# Altium project mb1045.PrjPCB (part 1 of 3)
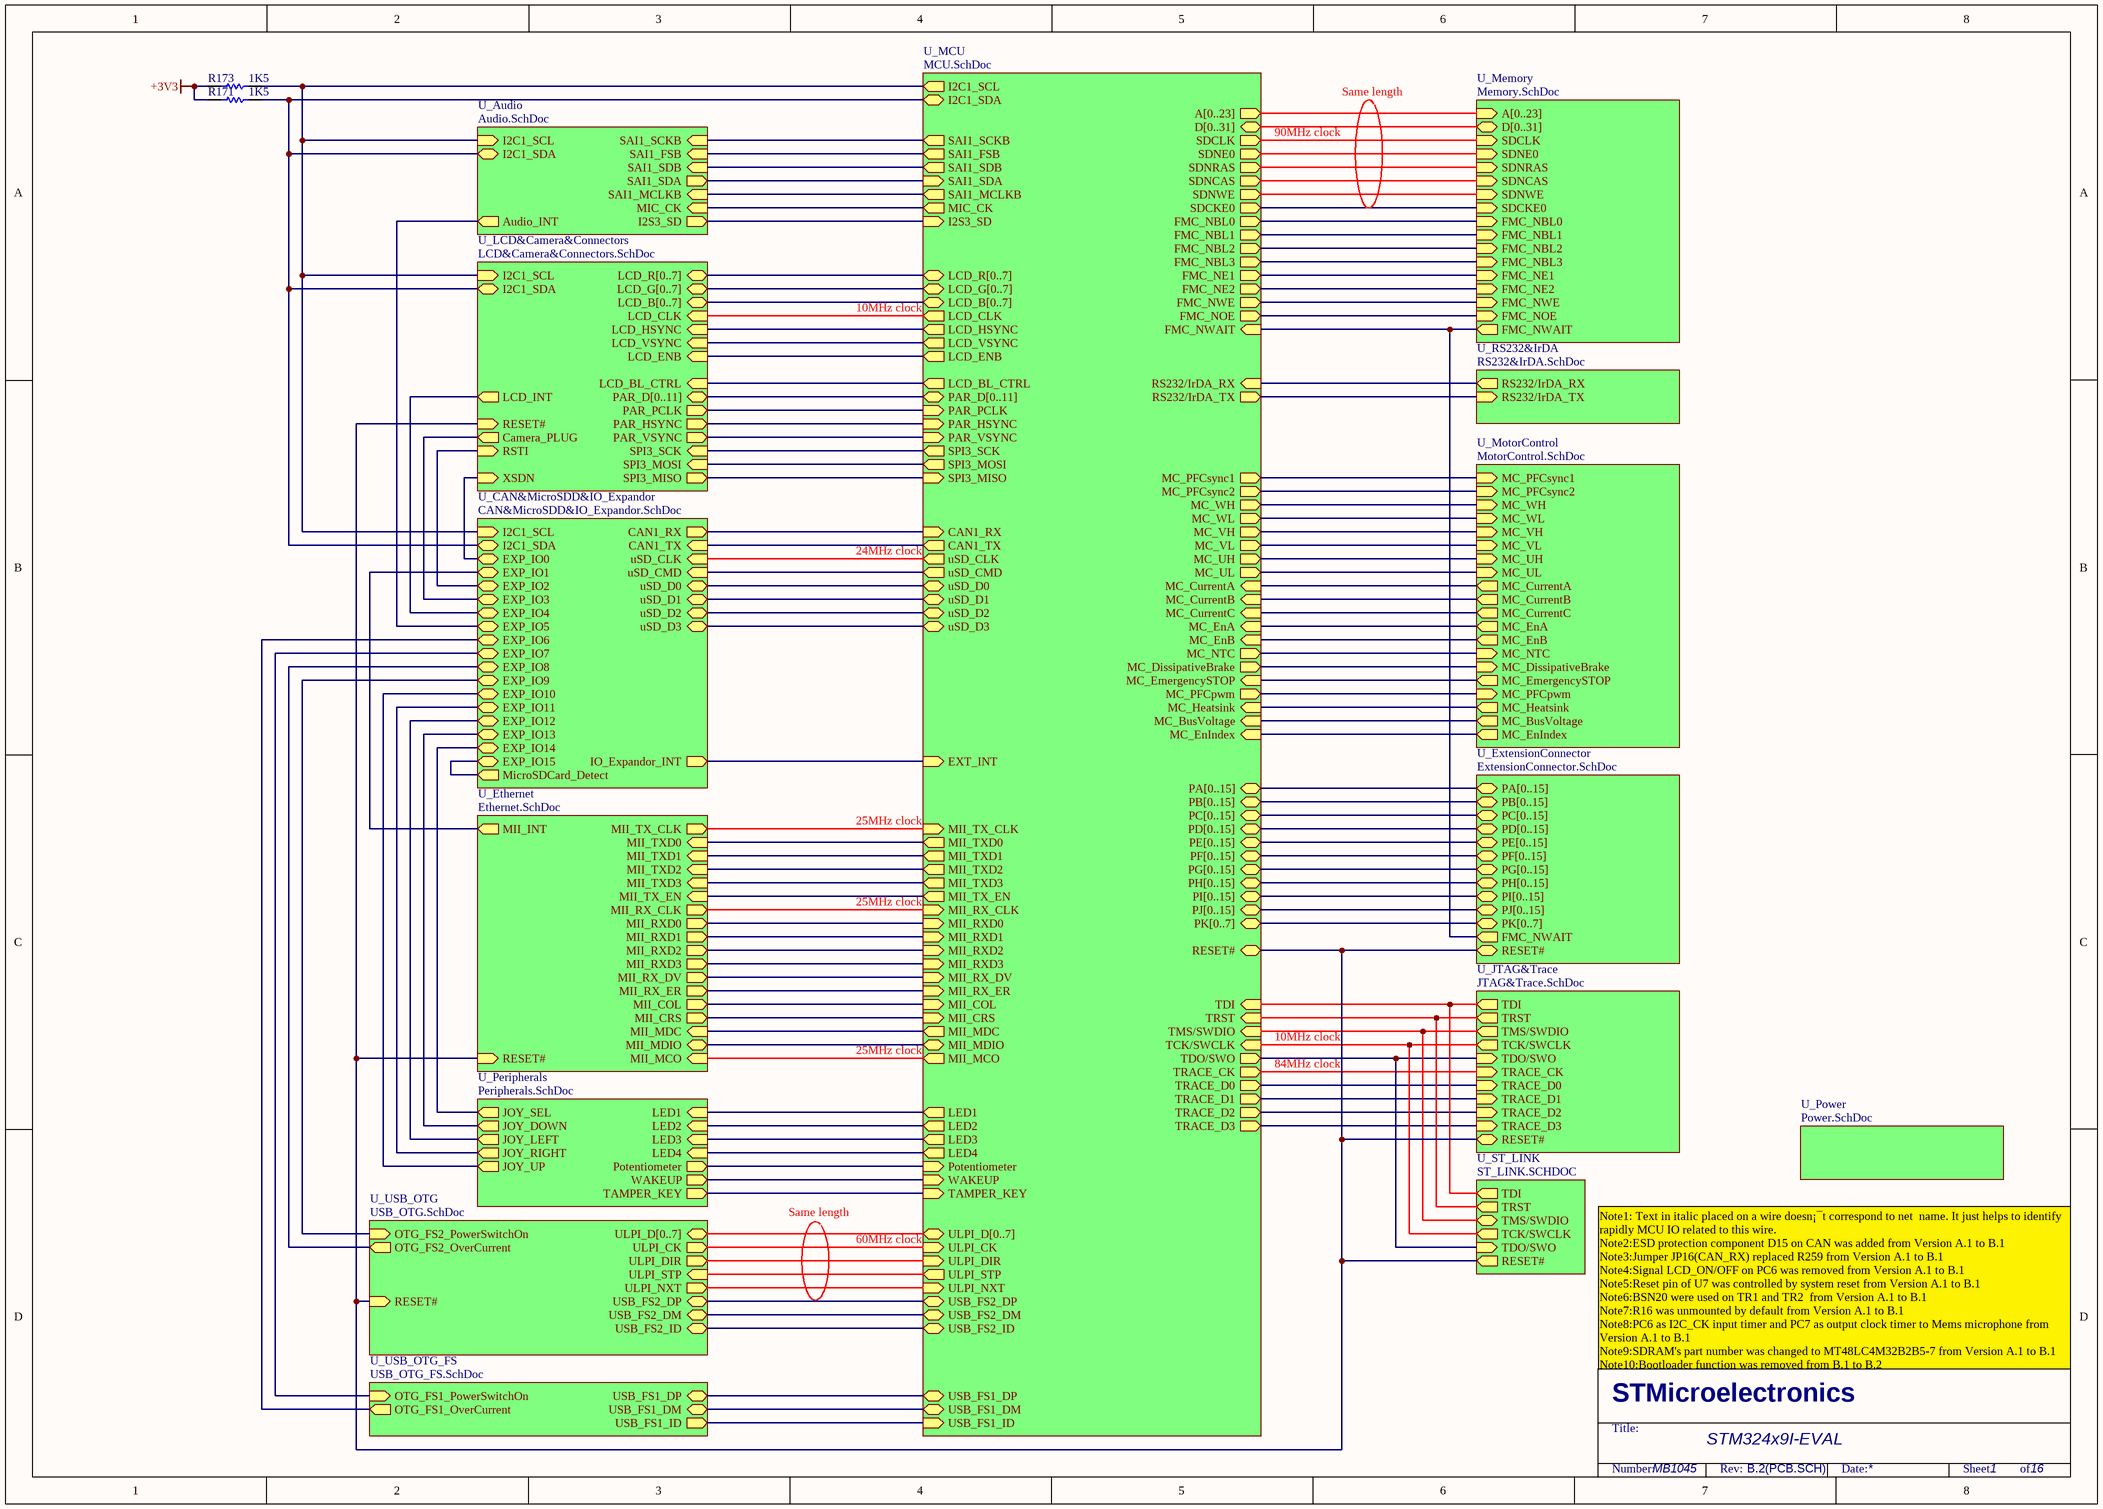
[diagram p0: mb1045.SchDoc]
16 sheets, 609 parts. Net scope: hierarchical (ports join the sheet entries above them; power ports are global).
Sheets:
  mb1045.SchDoc
    U_Audio = Audio.SchDoc
    U_JTAG&Trace = JTAG&Trace.SchDoc
    U_MCU = MCU.SchDoc
    U_Memory = Memory.SchDoc
    U_MotorControl = MotorControl.SchDoc
    U_Peripherals = Peripherals.SchDoc
    U_Power = Power.SchDoc
    U_RS232&IrDA = RS232&IrDA.SchDoc
    U_ST_LINK = ST_LINK.SCHDOC
    U_USB_OTG = USB_OTG.SchDoc
    U_USB_OTG_FS = USB_OTG_FS.SchDoc
    U_CAN&MicroSDD&IO_Expandor = CAN&MicroSDD&IO_Expandor.SchDoc
    U_ExtensionConnector = ExtensionConnector.SchDoc
    U_LCD&Camera&Connectors = LCD&Camera&Connectors.SchDoc
    U_Ethernet = Ethernet.SchDoc

## Sheet mb1045.SchDoc
size A3; Revision: B.2(PCB.SCH)

### Parts
R171  1K5  [0603R]
R173  1K5  [0603R]

### Sub-sheets
U_Audio = Audio.SchDoc: SAI1_SCKB (in), SAI1_FSB (in), SAI1_SDB (in), SAI1_SDA (out), Audio_INT (out), I2C1_SDA (bidir), I2C1_SCL (in), SAI1_MCLKB (in), MIC_CK (in), I2S3_SD (out)
U_CAN&MicroSDD&IO_Expandor = CAN&MicroSDD&IO_Expandor.SchDoc: CAN1_TX (in), CAN1_RX (out), uSD_CLK (in), uSD_CMD (in), uSD_D0 (bidir), uSD_D1 (bidir), uSD_D2 (bidir), uSD_D3 (bidir), MicroSDCard_Detect (out), I2C1_SCL (in), I2C1_SDA (bidir), IO_Expandor_INT (out), EXP_IO2 (bidir), EXP_IO3 (bidir), EXP_IO4 (bidir), EXP_IO5 (bidir), EXP_IO6 (bidir), EXP_IO7 (bidir), EXP_IO8 (bidir), EXP_IO1 (bidir), EXP_IO9 (bidir), EXP_IO10 (bidir), EXP_IO11 (bidir), EXP_IO12 (bidir), EXP_IO13 (bidir), EXP_IO14 (bidir), EXP_IO15 (bidir), EXP_IO0 (bidir)
U_Ethernet = Ethernet.SchDoc: MII_TXD0 (in), MII_TX_EN (in), MII_TX_CLK (out), MII_RXD0 (out), MII_RX_ER (out), MII_RX_DV (out), MII_RX_CLK (out), MII_COL (out), MII_CRS (out), MII_MDC (in), MII_MDIO (bidir), RESET# (in), MII_TXD1 (in), MII_TXD2 (in), MII_TXD3 (in), MII_RXD1 (out), MII_RXD2 (out), MII_RXD3 (out), MII_INT (out), MII_MCO (in)
U_ExtensionConnector = ExtensionConnector.SchDoc: PA[0..15] (bidir), PB[0..15] (bidir), PC[0..15] (bidir), PD[0..15] (bidir), PE[0..15] (bidir), PF[0..15] (bidir), PG[0..15] (bidir), PH[0..15] (bidir), PI[0..15] (bidir), PJ[0..15] (bidir), PK[0..7] (bidir), RESET# (bidir), FMC_NWAIT (out)
U_JTAG&Trace = JTAG&Trace.SchDoc: TDI (out), RESET# (bidir), TRACE_D3 (in), TRACE_D2 (in), TRACE_D1 (in), TRACE_D0 (in), TRACE_CK (in), TRST (out), TMS/SWDIO (out), TCK/SWCLK (out), TDO/SWO (in)
U_LCD&Camera&Connectors = LCD&Camera&Connectors.SchDoc: LCD_R[0..7] (bidir), LCD_HSYNC (in), LCD_VSYNC (in), LCD_CLK (in), LCD_ENB (in), LCD_BL_CTRL (in), I2C1_SDA (bidir), I2C1_SCL (in), LCD_B[0..7] (bidir), LCD_G[0..7] (bidir), RSTI (in), XSDN (in), PAR_HSYNC (out), PAR_PCLK (out), PAR_VSYNC (out), PAR_D[0..11] (bidir), SPI3_SCK (in), SPI3_MISO (out), SPI3_MOSI (in), LCD_INT (out), Camera_PLUG (out), RESET# (in)
U_MCU = MCU.SchDoc: PA[0..15] (bidir), PB[0..15] (bidir), PC[0..15] (bidir), PD[0..15] (bidir), PE[0..15] (bidir), PF[0..15] (bidir), PG[0..15] (bidir), PH[0..15] (bidir), PI[0..15] (bidir), WAKEUP (in), MC_EnA (in), MII_RX_CLK (in), MC_EnB (in), MII_MDIO (bidir), MC_EnIndex (in), ULPI_CK (in), MC_EmergencySTOP (in), MII_RX_DV (in), MC_UL (out), LCD_BL_CTRL (out), MC_PFCsync1 (out), RS232/IrDA_TX (out), RS232/IrDA_RX (in), USB_FS1_ID (in), CAN1_RX (in), USB_FS1_DM (bidir), MC_PFCpwm (out), CAN1_TX (out), USB_FS1_DP (bidir), MC_PFCsync2 (out), TMS/SWDIO (in), TCK/SWCLK (in), TDI (in), MC_VL (out), MC_WL (out), TDO/SWO (out), MIC_CK (out), TRST (in), I2C1_SCL (out), MII_TXD3 (out), MC_DissipativeBrake (out), I2C1_SDA (bidir), USB_FS2_ID (bidir), USB_FS2_DM (bidir), USB_FS2_DP (bidir), ULPI_STP (out), MII_MDC (out), MC_CurrentA (in), MII_TXD2 (out), MC_CurrentB (in), MII_TX_CLK (in), MC_CurrentC (in), MII_RXD0 (in), MC_BusVoltage (in), MII_RXD1 (in), MC_Heatsink (in), MC_UH (out), MC_VH (out), uSD_D0 (bidir), MC_WH (out), uSD_D1 (bidir), uSD_D2 (bidir), SPI3_SCK (out), uSD_D3 (bidir), SPI3_MISO (in), uSD_CLK (out), SPI3_MOSI (out), TAMPER_KEY (in), MII_CRS (in), LCD_ENB (out), uSD_CMD (out), FMC_NOE (out), FMC_NWE (out), FMC_NWAIT (in), I2S3_SD (in), FMC_NE1 (out), FMC_NBL3 (out), FMC_NBL2 (out), EXT_INT (in), MII_RX_ER (in), ULPI_DIR (in), LCD_HSYNC (out), LCD_VSYNC (out), LCD_CLK (out), FMC_NBL0 (out), FMC_NBL1 (out), TRACE_CK (out), TRACE_D0 (out), TRACE_D2 (out), TRACE_D1 (out), SAI1_SDA (in), TRACE_D3 (out), SAI1_SDB (out), SAI1_SCKB (out), SAI1_FSB (out), SAI1_MCLKB (out), Potentiometer (in), SDNRAS (out), LED1 (out), LED2 (out), SDCLK (out), FMC_NE2 (out), LED4 (out), LED3 (out), MII_TX_EN (out), MC_NTC (out), MII_TXD0 (out), MII_TXD1 (out), SDNCAS (out), SDCKE0 (out), SDNE0 (out), MII_COL (in), ULPI_NXT (in), SDNWE (out), MII_RXD2 (in), MII_RXD3 (in), LCD_R[0..7] (bidir), LCD_G[0..7] (bidir), LCD_B[0..7] (bidir), D[0..31] (bidir), A[0..23] (out), ULPI_D[0..7] (bidir), RESET# (bidir), PJ[0..15] (bidir), PK[0..7] (bidir), PAR_HSYNC (in), PAR_PCLK (in), PAR_VSYNC (in), PAR_D[0..11] (bidir), MII_MCO (out)
U_Memory = Memory.SchDoc: FMC_NE2 (in), FMC_NE1 (in), FMC_NWE (in), FMC_NOE (in), FMC_NWAIT (out), FMC_NBL0 (in), FMC_NBL1 (in), D[0..31] (bidir), A[0..23] (in), SDNCAS (in), SDNWE (in), SDNRAS (in), SDNE0 (in), SDCKE0 (in), SDCLK (in), FMC_NBL3 (in), FMC_NBL2 (in)
U_MotorControl = MotorControl.SchDoc: MC_EmergencySTOP (out), MC_CurrentA (out), MC_CurrentB (out), MC_CurrentC (out), MC_PFCsync1 (in), MC_PFCsync2 (in), MC_WL (in), MC_VH (in), MC_VL (in), MC_UH (in), MC_UL (in), MC_WH (in), MC_NTC (in), MC_DissipativeBrake (in), MC_PFCpwm (in), MC_EnA (out), MC_EnB (out), MC_Heatsink (out), MC_BusVoltage (out), MC_EnIndex (out)
U_Peripherals = Peripherals.SchDoc: LED4 (in), LED3 (in), LED1 (in), LED2 (in), JOY_SEL (out), JOY_DOWN (out), JOY_LEFT (out), JOY_RIGHT (out), JOY_UP (out), Potentiometer (out), WAKEUP (out), TAMPER_KEY (out)
U_Power = Power.SchDoc: no entries
U_RS232&IrDA = RS232&IrDA.SchDoc: RS232/IrDA_TX (in), RS232/IrDA_RX (out)
U_ST_LINK = ST_LINK.SCHDOC: TDI (out), TRST (out), TMS/SWDIO (bidir), TCK/SWCLK (out), TDO/SWO (in), RESET# (out)
U_USB_OTG = USB_OTG.SchDoc: ULPI_D[0..7] (bidir), ULPI_CK (out), ULPI_DIR (out), ULPI_NXT (out), ULPI_STP (in), RESET# (in), USB_FS2_DM (bidir), USB_FS2_DP (bidir), OTG_FS2_PowerSwitchOn (in), OTG_FS2_OverCurrent (out), USB_FS2_ID (bidir)
U_USB_OTG_FS = USB_OTG_FS.SchDoc: OTG_FS1_PowerSwitchOn (in), OTG_FS1_OverCurrent (out), USB_FS1_DM (bidir), USB_FS1_DP (bidir), USB_FS1_ID (out)

### Nets
+3V3: R171.1 R173.1
I2C1_SCL: R173.2 ; sheet U_Audio/I2C1_SCL, sheet U_MCU/I2C1_SCL, sheet U_CAN&MicroSDD&IO_Expandor/I2C1_SCL, sheet U_LCD&Camera&Connectors/I2C1_SCL
I2C1_SDA: R171.2 ; sheet U_Audio/I2C1_SDA, sheet U_MCU/I2C1_SDA, sheet U_CAN&MicroSDD&IO_Expandor/I2C1_SDA, sheet U_LCD&Camera&Connectors/I2C1_SDA
PA4: sheet U_MCU/PAR_HSYNC, sheet U_LCD&Camera&Connectors/PAR_HSYNC
PA5: sheet U_MCU/ULPI_CK, sheet U_USB_OTG/ULPI_CK
PA6: sheet U_MCU/MC_EmergencySTOP, sheet U_MCU/PAR_PCLK, sheet U_MotorControl/MC_EmergencySTOP, sheet U_LCD&Camera&Connectors/PAR_PCLK
PA10: sheet U_MCU/RS232/IrDA_RX, sheet U_MCU/USB_FS1_ID, sheet U_RS232&IrDA/RS232/IrDA_RX, sheet U_USB_OTG_FS/USB_FS1_ID
PA11: sheet U_MCU/USB_FS1_DM, sheet U_USB_OTG_FS/USB_FS1_DM
PA13: sheet U_JTAG&Trace/TMS/SWDIO, sheet U_MCU/TMS/SWDIO, sheet U_ST_LINK/TMS/SWDIO
PA14: sheet U_JTAG&Trace/TCK/SWCLK, sheet U_MCU/TCK/SWCLK, sheet U_ST_LINK/TCK/SWCLK
PA15: sheet U_JTAG&Trace/TDI, sheet U_MCU/TDI, sheet U_ST_LINK/TDI
PAR_D1: sheet U_MCU/MC_VH, sheet U_MotorControl/MC_VH
PAR_D4: sheet U_MCU/SPI3_MISO, sheet U_LCD&Camera&Connectors/SPI3_MISO
PAR_D8: sheet U_MCU/SPI3_SCK, sheet U_LCD&Camera&Connectors/SPI3_SCK
PAR_D9: sheet U_MCU/uSD_CLK, sheet U_MCU/SPI3_MOSI, sheet U_CAN&MicroSDD&IO_Expandor/uSD_CLK, sheet U_LCD&Camera&Connectors/SPI3_MOSI
PB4: sheet U_JTAG&Trace/TRST, sheet U_MCU/TRST, sheet U_ST_LINK/TRST
PB7: sheet U_MCU/PAR_VSYNC, sheet U_LCD&Camera&Connectors/PAR_VSYNC
PB14: sheet U_MCU/USB_FS2_DM, sheet U_USB_OTG/USB_FS2_DM
PB15: sheet U_MCU/USB_FS2_DP, sheet U_USB_OTG/USB_FS2_DP
PC0: sheet U_MCU/ULPI_STP, sheet U_USB_OTG/ULPI_STP
PC13: sheet U_MCU/TAMPER_KEY, sheet U_Peripherals/TAMPER_KEY
PD4: sheet U_MCU/FMC_NOE, sheet U_Memory/FMC_NOE
PD5: sheet U_MCU/FMC_NWE, sheet U_Memory/FMC_NWE
PD7: sheet U_MCU/FMC_NE1, sheet U_Memory/FMC_NE1
PE0: sheet U_MCU/FMC_NBL0, sheet U_Memory/FMC_NBL0
PE1: sheet U_MCU/FMC_NBL1, sheet U_Memory/FMC_NBL1
PF6: sheet U_Audio/SAI1_SDB, sheet U_MCU/SAI1_SDB
PF7: sheet U_Audio/SAI1_MCLKB, sheet U_MCU/SAI1_MCLKB
PF8: sheet U_Audio/SAI1_SCKB, sheet U_MCU/SAI1_SCKB
PF9: sheet U_Audio/SAI1_FSB, sheet U_MCU/SAI1_FSB
PF10: sheet U_MCU/Potentiometer, sheet U_Peripherals/Potentiometer
PF11: sheet U_MCU/SDNRAS, sheet U_Memory/SDNRAS
PG6: sheet U_MCU/LED1, sheet U_Peripherals/LED1
PG7: sheet U_MCU/LED2, sheet U_Peripherals/LED2
PG8: sheet U_MCU/SDCLK, sheet U_Memory/SDCLK
PG9: sheet U_MCU/FMC_NE2, sheet U_Memory/FMC_NE2
PG10: sheet U_MCU/LED3, sheet U_Peripherals/LED3
PG12: sheet U_MCU/LED4, sheet U_Peripherals/LED4
PG15: sheet U_MCU/SDNCAS, sheet U_Memory/SDNCAS
PH2: sheet U_MCU/SDCKE0, sheet U_Memory/SDCKE0
PH3: sheet U_MCU/SDNE0, sheet U_Memory/SDNE0
PH4: sheet U_MCU/ULPI_NXT, sheet U_USB_OTG/ULPI_NXT
PH5: sheet U_MCU/SDNWE, sheet U_Memory/SDNWE
PH6: sheet U_MCU/MII_RXD2, sheet U_Ethernet/MII_RXD2
PH7: sheet U_MCU/MII_RXD3, sheet U_Ethernet/MII_RXD3
PI4: sheet U_MCU/FMC_NBL2, sheet U_Memory/FMC_NBL2
PI5: sheet U_MCU/FMC_NBL3, sheet U_Memory/FMC_NBL3
PI8: sheet U_MCU/EXT_INT, sheet U_CAN&MicroSDD&IO_Expandor/IO_Expandor_INT
PI11: sheet U_MCU/ULPI_DIR, sheet U_USB_OTG/ULPI_DIR
PI12: sheet U_MCU/LCD_HSYNC, sheet U_LCD&Camera&Connectors/LCD_HSYNC
PI13: sheet U_MCU/LCD_VSYNC, sheet U_LCD&Camera&Connectors/LCD_VSYNC
PI14: sheet U_MCU/LCD_CLK, sheet U_LCD&Camera&Connectors/LCD_CLK
PK7: sheet U_MCU/LCD_ENB, sheet U_LCD&Camera&Connectors/LCD_ENB
RESET#: sheet U_JTAG&Trace/RESET#, sheet U_MCU/RESET#, sheet U_ST_LINK/RESET#, sheet U_USB_OTG/RESET#, sheet U_ExtensionConnector/RESET#, sheet U_LCD&Camera&Connectors/RESET#, sheet U_Ethernet/RESET#
T_JTDO: sheet U_JTAG&Trace/TDO/SWO, sheet U_MCU/TDO/SWO, sheet U_ST_LINK/TDO/SWO
NetB4_1: sheet U_Peripherals/JOY_LEFT, sheet U_CAN&MicroSDD&IO_Expandor/EXP_IO12
NetB4_2: sheet U_Peripherals/JOY_SEL, sheet U_CAN&MicroSDD&IO_Expandor/EXP_IO14
NetB4_3: sheet U_Peripherals/JOY_DOWN, sheet U_CAN&MicroSDD&IO_Expandor/EXP_IO13
NetB4_4: sheet U_Peripherals/JOY_RIGHT, sheet U_CAN&MicroSDD&IO_Expandor/EXP_IO11
NetB4_6: sheet U_Peripherals/JOY_UP, sheet U_CAN&MicroSDD&IO_Expandor/EXP_IO10
NetC6_2: sheet U_MCU/MC_EnA, sheet U_MotorControl/MC_EnA
NetC7_2: sheet U_MCU/MC_PFCsync2, sheet U_MotorControl/MC_PFCsync2
NetC8_2: sheet U_MCU/MC_EnB, sheet U_MotorControl/MC_EnB
NetC9_2: sheet U_MCU/MC_EnIndex, sheet U_MotorControl/MC_EnIndex
NetC10_2: sheet U_MCU/MC_PFCpwm, sheet U_MotorControl/MC_PFCpwm
NetC11_1: sheet U_MCU/MC_Heatsink, sheet U_MotorControl/MC_Heatsink
NetC12_2: sheet U_MCU/MC_CurrentC, sheet U_MotorControl/MC_CurrentC
NetC13_2: sheet U_MCU/MC_CurrentB, sheet U_MotorControl/MC_CurrentB
NetC14_2: sheet U_MCU/MC_CurrentA, sheet U_MotorControl/MC_CurrentA
NetC15_1: sheet U_MCU/MC_BusVoltage, sheet U_MotorControl/MC_BusVoltage
NetC18_2: sheet U_MCU/MC_PFCsync1, sheet U_MotorControl/MC_PFCsync1
NetCN1_3: sheet U_MCU/MC_UH, sheet U_MotorControl/MC_UH
NetCN1_5: sheet U_MCU/MC_UL, sheet U_MotorControl/MC_UL
NetCN1_9: sheet U_MCU/MC_VL, sheet U_MotorControl/MC_VL
NetCN1_11: sheet U_MCU/MC_WH, sheet U_MotorControl/MC_WH
NetCN1_13: sheet U_MCU/MC_WL, sheet U_MotorControl/MC_WL
NetCN1_21: sheet U_MCU/MC_NTC, sheet U_MotorControl/MC_NTC
NetCN1_23: sheet U_MCU/MC_DissipativeBrake, sheet U_MotorControl/MC_DissipativeBrake
NetCN5_15: sheet U_CAN&MicroSDD&IO_Expandor/EXP_IO3, sheet U_LCD&Camera&Connectors/Camera_PLUG
NetCN12_6: sheet U_MCU/FMC_NWAIT, sheet U_Memory/FMC_NWAIT, sheet U_ExtensionConnector/FMC_NWAIT
NetCN13_12: sheet U_JTAG&Trace/TRACE_CK, sheet U_MCU/TRACE_CK
NetCN13_14: sheet U_JTAG&Trace/TRACE_D0, sheet U_MCU/TRACE_D0
NetCN13_16: sheet U_JTAG&Trace/TRACE_D1, sheet U_MCU/TRACE_D1
NetCN13_18: sheet U_JTAG&Trace/TRACE_D2, sheet U_MCU/TRACE_D2
NetCN13_20: sheet U_JTAG&Trace/TRACE_D3, sheet U_MCU/TRACE_D3
NetCN15_4: sheet U_MCU/USB_FS2_ID, sheet U_USB_OTG/USB_FS2_ID
NetCN17_1: sheet U_MCU/uSD_D2, sheet U_CAN&MicroSDD&IO_Expandor/uSD_D2
NetCN17_2: sheet U_MCU/uSD_D3, sheet U_CAN&MicroSDD&IO_Expandor/uSD_D3
NetCN17_3: sheet U_MCU/uSD_CMD, sheet U_CAN&MicroSDD&IO_Expandor/uSD_CMD
NetCN17_7: sheet U_MCU/uSD_D0, sheet U_CAN&MicroSDD&IO_Expandor/uSD_D0
NetCN17_8: sheet U_MCU/uSD_D1, sheet U_CAN&MicroSDD&IO_Expandor/uSD_D1
NetCN20_39: sheet U_CAN&MicroSDD&IO_Expandor/EXP_IO4, sheet U_LCD&Camera&Connectors/LCD_INT
NetCN20_43: sheet U_MCU/LCD_BL_CTRL, sheet U_LCD&Camera&Connectors/LCD_BL_CTRL
NetD5_C3: sheet U_MCU/USB_FS1_DP, sheet U_USB_OTG_FS/USB_FS1_DP
NetJP5_3: sheet U_Audio/I2S3_SD, sheet U_MCU/I2S3_SD
NetJP6_3: sheet U_MCU/MII_MCO, sheet U_Ethernet/MII_MCO
NetJP15_3: sheet U_Audio/MIC_CK, sheet U_MCU/MIC_CK
NetJP16_2: sheet U_MCU/CAN1_RX, sheet U_CAN&MicroSDD&IO_Expandor/CAN1_RX
NetR43_1: sheet U_MCU/MII_RX_ER, sheet U_Ethernet/MII_RX_ER
NetR48_2: sheet U_MCU/MII_RXD1, sheet U_Ethernet/MII_RXD1
NetR49_2: sheet U_MCU/MII_RXD0, sheet U_Ethernet/MII_RXD0
NetR50_2: sheet U_MCU/MII_RX_DV, sheet U_Ethernet/MII_RX_DV
NetR51_2: sheet U_MCU/MII_RX_CLK, sheet U_Ethernet/MII_RX_CLK
NetR63_2: sheet U_MCU/MII_TX_CLK, sheet U_Ethernet/MII_TX_CLK
NetR75_1: sheet U_MCU/MII_MDIO, sheet U_Ethernet/MII_MDIO
NetR76_2: sheet U_CAN&MicroSDD&IO_Expandor/EXP_IO1, sheet U_Ethernet/MII_INT
NetR95_2: sheet U_USB_OTG/OTG_FS2_PowerSwitchOn, sheet U_CAN&MicroSDD&IO_Expandor/EXP_IO9
NetR120_2: sheet U_Audio/SAI1_SDA, sheet U_MCU/SAI1_SDA
NetR124_1: sheet U_USB_OTG/OTG_FS2_OverCurrent, sheet U_CAN&MicroSDD&IO_Expandor/EXP_IO8
NetR130_2: sheet U_USB_OTG_FS/OTG_FS1_PowerSwitchOn, sheet U_CAN&MicroSDD&IO_Expandor/EXP_IO7
NetR132_1: sheet U_USB_OTG_FS/OTG_FS1_OverCurrent, sheet U_CAN&MicroSDD&IO_Expandor/EXP_IO6
NetR150_1: sheet U_CAN&MicroSDD&IO_Expandor/MicroSDCard_Detect, sheet U_CAN&MicroSDD&IO_Expandor/EXP_IO15
NetR193_2: sheet U_MCU/WAKEUP, sheet U_Peripherals/WAKEUP
NetR206_2: sheet U_CAN&MicroSDD&IO_Expandor/EXP_IO2, sheet U_LCD&Camera&Connectors/RSTI
NetR222_1: sheet U_MCU/MII_MDC, sheet U_Ethernet/MII_MDC
NetR228_1: sheet U_MCU/MII_TXD2, sheet U_Ethernet/MII_TXD2
NetR229_2: sheet U_CAN&MicroSDD&IO_Expandor/EXP_IO0, sheet U_LCD&Camera&Connectors/XSDN
NetR233_2: sheet U_MCU/MII_TXD0, sheet U_Ethernet/MII_TXD0
NetR236_2: sheet U_MCU/MII_TXD1, sheet U_Ethernet/MII_TXD1
NetR243_1: sheet U_MCU/MII_TXD3, sheet U_Ethernet/MII_TXD3
NetR249_2: sheet U_MCU/MII_TX_EN, sheet U_Ethernet/MII_TX_EN
NetR256_2: sheet U_MCU/CAN1_TX, sheet U_CAN&MicroSDD&IO_Expandor/CAN1_TX
NetR262_2: sheet U_MCU/RS232/IrDA_TX, sheet U_RS232&IrDA/RS232/IrDA_TX
NetSB7_1: sheet U_MCU/MII_CRS, sheet U_Ethernet/MII_CRS
NetSB8_2: sheet U_MCU/MII_COL, sheet U_Ethernet/MII_COL
NetU16_6: sheet U_Audio/Audio_INT, sheet U_CAN&MicroSDD&IO_Expandor/EXP_IO5

### Buses and harness runs
bus sheet U_ExtensionConnector/PA[0..15] = sheet U_MCU/PA[0..15]
bus sheet U_ExtensionConnector/PB[0..15] = sheet U_MCU/PB[0..15]
bus sheet U_ExtensionConnector/PC[0..15] = sheet U_MCU/PC[0..15]
bus sheet U_ExtensionConnector/PD[0..15] = sheet U_MCU/PD[0..15]
bus sheet U_ExtensionConnector/PE[0..15] = sheet U_MCU/PE[0..15]
bus sheet U_ExtensionConnector/PF[0..15] = sheet U_MCU/PF[0..15]
bus sheet U_ExtensionConnector/PG[0..15] = sheet U_MCU/PG[0..15]
bus sheet U_ExtensionConnector/PH[0..15] = sheet U_MCU/PH[0..15]
bus sheet U_ExtensionConnector/PI[0..15] = sheet U_MCU/PI[0..15]
bus sheet U_ExtensionConnector/PJ[0..15] = sheet U_MCU/PJ[0..15]
bus sheet U_ExtensionConnector/PK[0..7] = sheet U_MCU/PK[0..7]
bus sheet U_LCD&Camera&Connectors/LCD_B[0..7] = sheet U_MCU/LCD_B[0..7]
bus sheet U_LCD&Camera&Connectors/LCD_G[0..7] = sheet U_MCU/LCD_G[0..7]
bus sheet U_LCD&Camera&Connectors/LCD_R[0..7] = sheet U_MCU/LCD_R[0..7]
bus sheet U_LCD&Camera&Connectors/PAR_D[0..11] = sheet U_MCU/PAR_D[0..11]
bus sheet U_MCU/A[0..23] = sheet U_Memory/A[0..23]
bus sheet U_MCU/D[0..31] = sheet U_Memory/D[0..31]
bus sheet U_MCU/ULPI_D[0..7] = sheet U_USB_OTG/ULPI_D[0..7]

### Notes on the sheet
- Same length
- 90MHz clock
- 10MHz clock
- 24MHz clock
- 25MHz clock
- 84MHz clock
- 60MHz clock
- Note1: Text in italic placed on a wire doesn¡¯t correspond to net  name. It just helps to identify rapidly MCU IO related to this wire.
  Note2:ESD protection component D15 on CAN was added from Version A.1 to B.1
  Note3:Jumper JP16(CAN_RX) replaced R259 from Version A.1 to B.1
  Note4:Signal LCD_ON/OFF on PC6 was removed from Version A.1 to B.1
  Note5:Reset pin of U7 was controlled by system reset from Version A.1 to B.1
  Note6:BSN20 were used on TR1 and TR2  from Version A.1 to B.1
  Note7:R16 was unmounted by default from Version A.1 to B.1
  Note8:PC6 as I2C_CK input timer and PC7 as output clock timer to Mems microphone from Version A.1 to B.1
  Note9:SDRAM's part number was changed to MT48LC4M32B2B5-7 from Version A.1 to B.1
  Note10:Bootloader function was removed from B.1 to B.2
- STM324x9I-EVAL
- MB1045
- 1
- 16
- STMicroelectronics
- Title:
- Number:
- Rev:
- Date:
- Sheet          of

### Library data of the parts
R171 R173 = Res1: Resistor; Value: 1K; Published: 8-Jun-2000; Revision: July-2002: Re-released for DXP Platform.; Publisher: Altium Limited

## Sheet Audio.SchDoc
size A4; Revision: B.2(PCB.SCH)
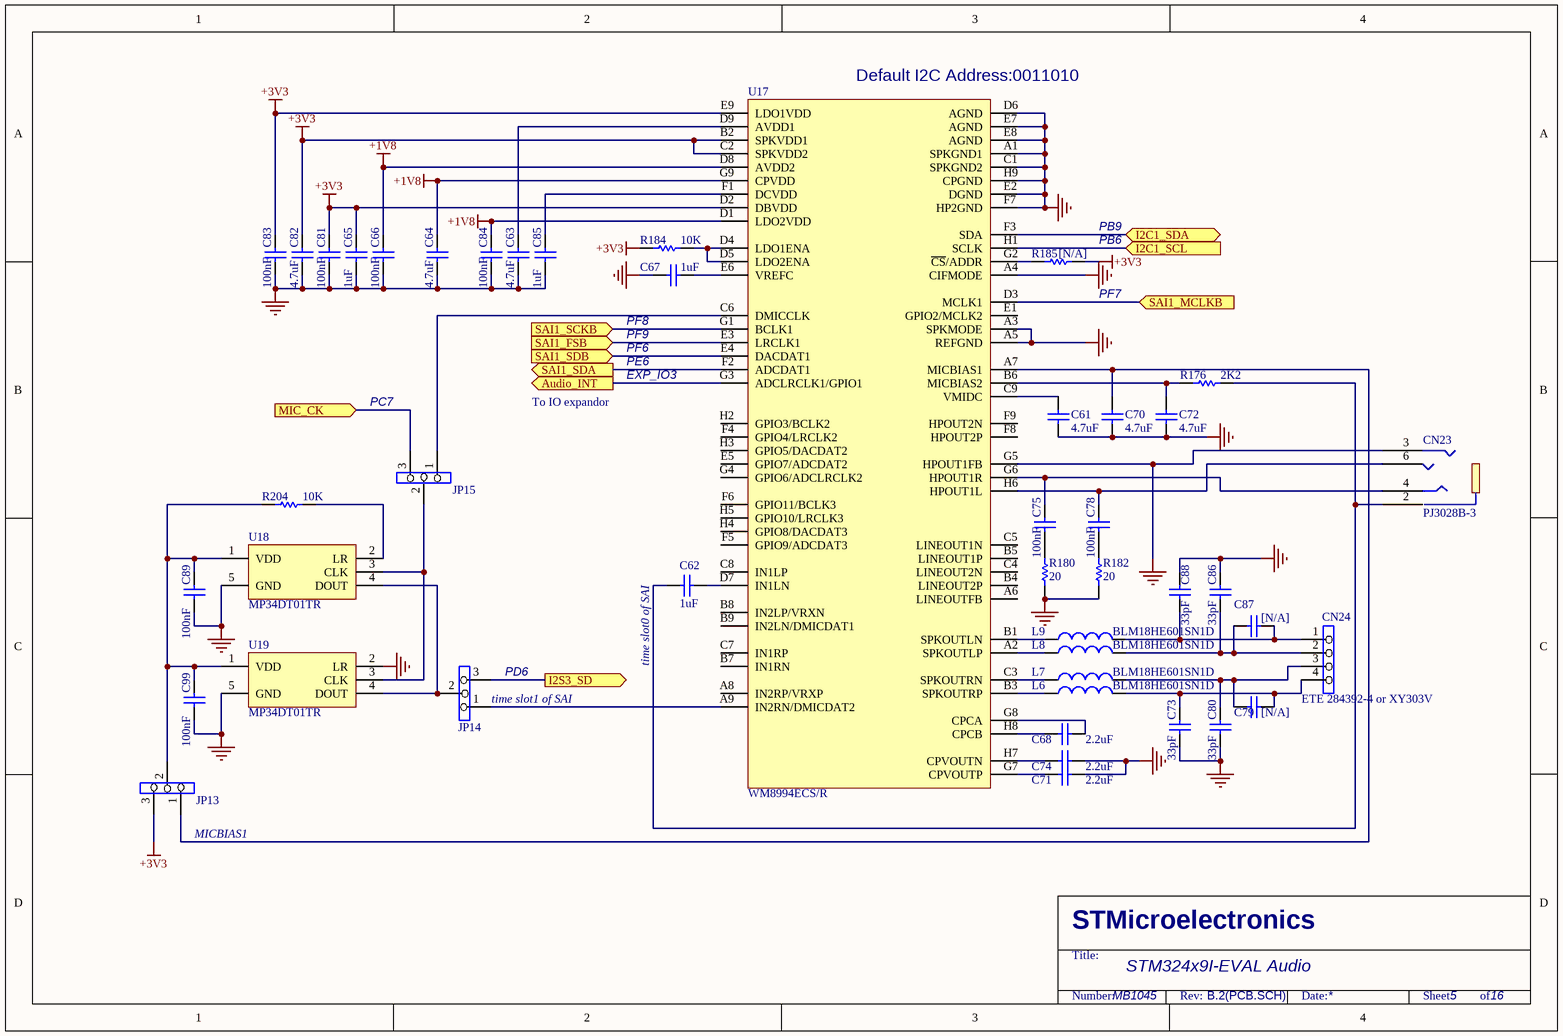
[diagram p1: Audio.SchDoc]

### Parts
C61  4.7uF  [0603C]
C62  1uF  [0603C]
C63  4.7uF  [0603C]
C64  4.7uF  [0603C]
C65  1uF  [0603C]
C66  100nF  [0603C]
C67  1uF  [0603C]
C68  2.2uF  [0603C]
C70  4.7uF  [0603C]
C71  2.2uF  [0603C]
C72  4.7uF  [0603C]
C73  33pF  [0603C]
C74  2.2uF  [0603C]
C75  100nF  [0603C]
C78  100nF  [0603C]
C79  [N/A]  [0603C]
C80  33pF  [0603C]
C81  100nF  [0603C]
C82  4.7uF  [0603C]
C83  100nF  [0603C]
C84  100nF  [0603C]
C85  1uF  [0603C]
C86  33pF  [0603C]
C87  [N/A]  [0603C]
C88  33pF  [0603C]
C89  100nF  [0603C]
C99  100nF  [0603C]
CN23  PJ3028B-3  [PJ3028B]
CN24  ETE 284392-4 or XY303V  [BUCHANAN_284392-4]
JP13  (no value)  [SIP3]
JP14  (no value)  [SIP3]
JP15  (no value)  [SIP3]
L6  BLM18HE601SN1D  [0603L]
L7  BLM18HE601SN1D  [0603L]
L8  BLM18HE601SN1D  [0603L]
L9  BLM18HE601SN1D  [0603L]
R176  2K2  [0603R]
R180  20  [0603R]
R182  20  [0603R]
R184  10K  [0603R]
R185  [N/A]  [0603R]
R204  10K  [0603R]
U17  WM8994ECS/R  [BGA72_0R5_4R5X4]
U18  MP34DT01TR  [MP34DT01TR]
U19  MP34DT01TR  [MP34DT01TR]

### Ports
Audio_INT (out), I2C1_SCL (in), I2C1_SDA (bidir), I2S3_SD (out), MIC_CK (in), SAI1_FSB (in), SAI1_MCLKB (in), SAI1_SCKB (in), SAI1_SDA (out), SAI1_SDB (in)

### Nets
+1V8: C64.1 C66.1 C84.1 U17.D1(LDO2VDD) U17.D8(AVDD2) U17.G9(CPVDD)
+3V3: C65.1 C81.1 C82.1 C83.1 JP13.3 R184.2 R185.1 U17.B2(SPKVDD1) U17.C2(SPKVDD2) U17.D2(DBVDD) U17.E9(LDO1VDD)
GND: C61.1 C63.2 C64.2 C65.2 C66.2 C67.2 C70.1 C71.2 C72.1 C73.2 C74.2 C80.2 C81.2 C82.2 C83.2 C84.2 C85.2 C86.1 C88.1 C89.2 C99.2 CN23.3 R180.2 R182.2 U17.A1(SPKGND1) U17.A3(SPKMODE) U17.A4(CIFMODE) U17.A5(REFGND) U17.C1(SPKGND2) U17.D6(AGND) U17.E2(DGND) U17.E7(AGND) U17.E8(AGND) U17.F7(HP2GND) U17.G5(HPOUT1FB) U17.H9(CPGND) U18.5(GND) U19.2(LR) U19.5(GND)
I2C1_SCL: U17.H1(SCLK) ; port I2C1_SCL
I2C1_SDA: U17.F3(SDA) ; port I2C1_SDA
PF6: U17.E4(DACDAT1) ; port SAI1_SDB
PF7: U17.D3(MCLK1) ; port SAI1_MCLKB
PF8: U17.G1(BCLK1) ; port SAI1_SCKB
PF9: U17.E3(LRCLK1) ; port SAI1_FSB
NetC61_2: C61.2 U17.C9(VMIDC)
NetC62_1: C62.1 U17.D7(IN1LN)
NetC62_2: C62.2 CN23.2 R176.1
NetC63_1: C63.1 U17.D9(AVDD1)
NetC67_1: C67.1 U17.E6(VREFC)
NetC68_1: C68.1 U17.H8(CPCB)
NetC68_2: C68.2 U17.G8(CPCA)
NetC70_2: C70.2 JP13.1 U17.A7(MICBIAS1)
NetC71_1: C71.1 U17.G7(CPVOUTP)
NetC72_2: C72.2 R176.2 U17.B6(MICBIAS2)
NetC73_1: C73.1 C79.2 CN24.4 L6.2
NetC74_1: C74.1 U17.H7(CPVOUTN)
NetC75_1: C75.1 CN23.4 U17.G6(HPOUT1R)
NetC75_2: C75.2 R180.1
NetC78_1: C78.1 CN23.6 U17.H6(HPOUT1L)
NetC78_2: C78.2 R182.1
NetC79_1: C79.1 C80.1 CN24.3 L7.2
NetC85_1: C85.1 U17.F1(DCVDD)
NetC86_2: C86.2 C87.1 CN24.2 L8.2
NetC87_2: C87.2 C88.2 CN24.1 L9.2
NetC89_1: C89.1 C99.1 JP13.2 R204.2 U18.1(VDD) U19.1(VDD)
NetJP5_3: JP14.3 ; port I2S3_SD
NetJP14_1: JP14.1 U17.A9(IN2RN/DMICDAT2)
NetJP14_2: JP14.2 U18.4(DOUT) U19.4(DOUT)
NetJP15_1: JP15.1 U17.C6(DMICCLK)
NetJP15_2: JP15.2 U18.3(CLK) U19.3(CLK)
NetJP15_3: JP15.3 ; port MIC_CK
NetL6_1: L6.1 U17.B3(SPKOUTRP)
NetL7_1: L7.1 U17.C3(SPKOUTRN)
NetL8_1: L8.1 U17.A2(SPKOUTLP)
NetL9_1: L9.1 U17.B1(SPKOUTLN)
NetR120_2: U17.F2(ADCDAT1) ; port SAI1_SDA
NetR184_1: R184.1 U17.D4(LDO1ENA) U17.D5(LDO2ENA)
NetR185_2: R185.2 U17.G2(~{CS}/ADDR)
NetR204_1: R204.1 U18.2(LR)
NetU16_6: U17.G3(ADCLRCLK1/GPIO1) ; port Audio_INT

Not connected (* = marked no-connect by the designer): U17 A6(LINEOUTFB) A8(IN2RP/VRXP) B4(LINEOUT2P) B5(LINEOUT1P) B7(IN1RN) B8(IN2LP/VRXN) B9(IN2LN/DMICDAT1) C4(LINEOUT2N) C5(LINEOUT1N) C7(IN1RP) C8(IN1LP) E1(GPIO2/MCLK2) E5(GPIO7/ADCDAT2) F4(GPIO4/LRCLK2) F5(GPIO9/ADCDAT3) F6(GPIO11/BCLK3) F8(HPOUT2P) F9(HPOUT2N) G4(GPIO6/ADCLRCLK2) H2(GPIO3/BCLK2) H3(GPIO5/DACDAT2) H4(GPIO8/DACDAT3) H5(GPIO10/LRCLK3)

### Notes on the sheet
- (near U17) Default I2C Address:0011010
- (near R185) PB9
- (near R185) PB6
- (near R185) PF7
- PF6
- PF8
- PF9
- PE6
- EXP_IO3
- PC7
- To IO expandor
- (near JP14) time slot1 of SAI
- (near JP14) PD6
- (near C62) time slot0 of SAI
- (near JP13) MICBIAS1
- STM324x9I-EVAL Audio
- MB1045
- 5
- 16
- STMicroelectronics
- Title:
- Number:
- Rev:
- Date:
- Sheet          of

### Library data of the parts
C61 C63 C64 C66 C70 C72 C73 C75 C78-C84 C86-C89 C99 = Cap: Capacitor; Value: 10nF; Published: 8-Jun-2000; Revision: July-2002: Re-released for DXP Platform.; Publisher: Altium Limited
C62 C65 C67 C68 C71 C74 C85 = CAP: Capacitor; Value: 100nF; Published: 8-Jun-2000; Revision: July-2002: Re-released for DXP Platform.; Publisher: Altium Limited
CN24 = ETE 284392-4 or XY303V: ETE 284392-4
JP13-JP15 = Jumper3
L6-L9 = Inductor: Value: 100uH; Published: 8-Jun-2000; Revision: July-2002: Re-released for DXP Platform.; Publisher: Altium Limited
R176 R180 R182 R184 R185 R204 = Res1: Resistor; Value: 1K; Published: 8-Jun-2000; Revision: July-2002: Re-released for DXP Platform.; Publisher: Altium Limited
U18 U19 = MP34DT01TR: MEMS audio sensor; Revision: 17-Jul-2002: Re-released for DXP Platform.; Publisher: Altium Limited

## Sheet JTAG&Trace.SchDoc
size A4; Revision: B.2(PCB.SCH)
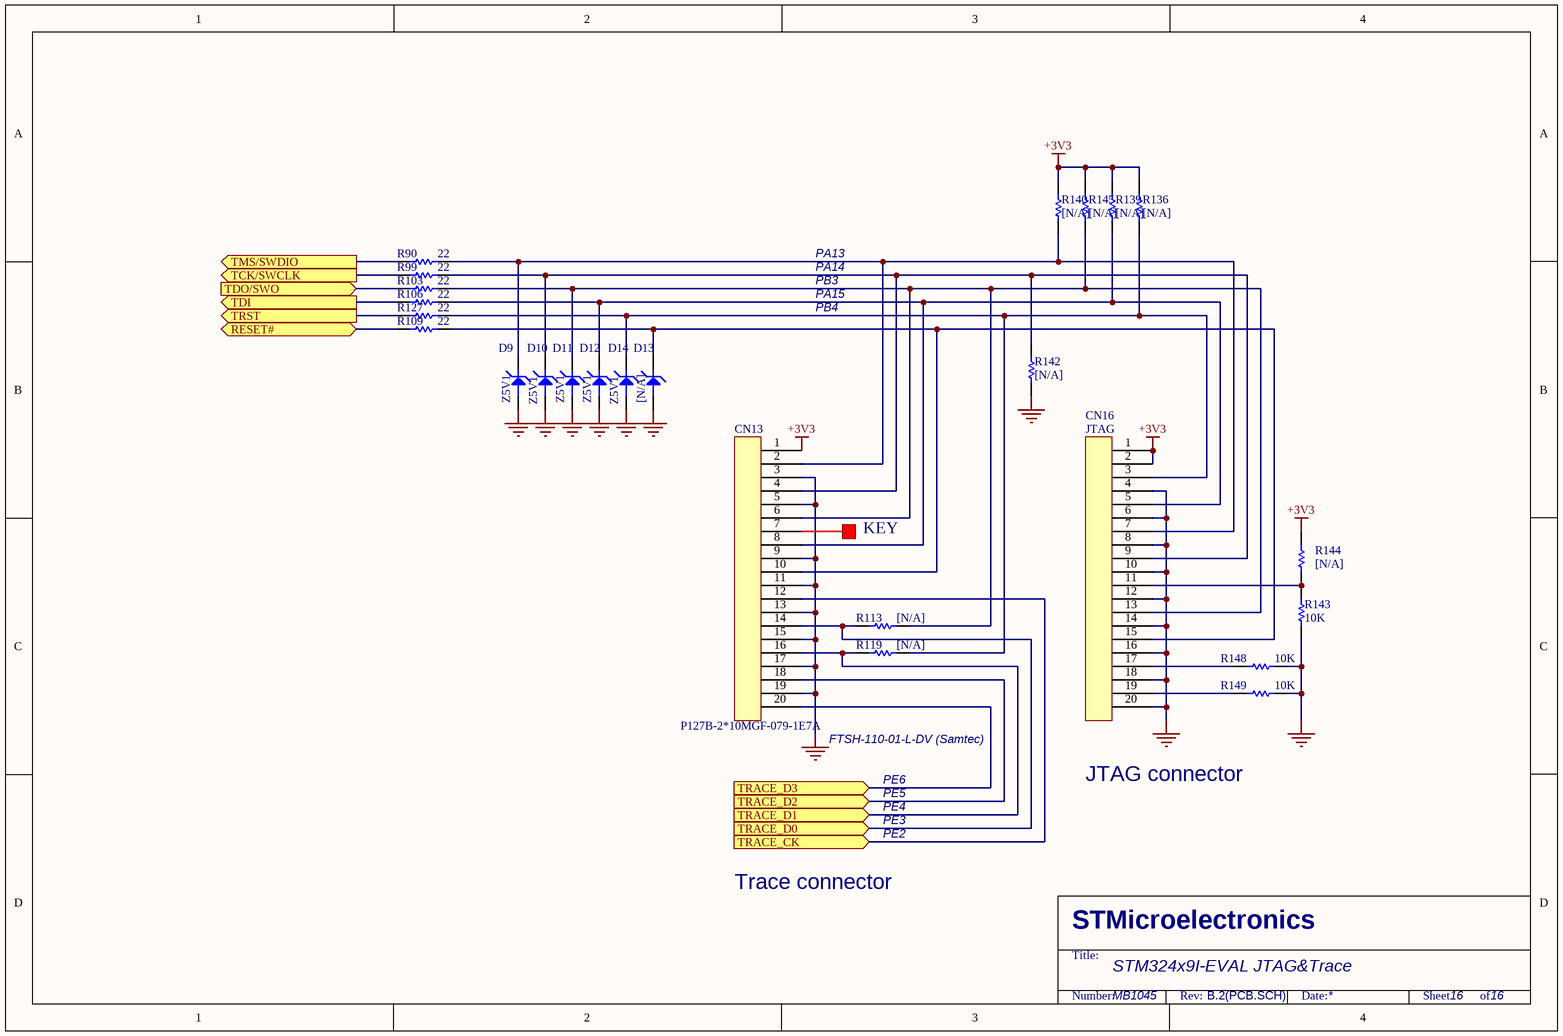
[diagram p2: JTAG&Trace.SchDoc]

### Parts
CN13  P127B-2*10MGF-079-1E7A  [FTSH-110-01-L-DV]
CN16  JTAG  [IDC20S]
D9  Z5V1  [SOT23-213]
D10  Z5V1  [SOT23-213]
D11  Z5V1  [SOT23-213]
D12  Z5V1  [SOT23-213]
D13  [N/A]  [SOT23-213]
D14  Z5V1  [SOT23-213]
R90  22  [0603R]
R99  22  [0603R]
R103  22  [0603R]
R106  22  [0603R]
R109  22  [0603R]
R113  [N/A]  [0603R]
R119  [N/A]  [0603R]
R127  22  [0603R]
R136  [N/A]  [0603R]
R139  [N/A]  [0603R]
R140  [N/A]  [0603R]
R142  [N/A]  [0603R]
R143  10K  [0603R]
R144  [N/A]  [0603R]
R145  [N/A]  [0603R]
R148  10K  [0603R]
R149  10K  [0603R]

### Ports
RESET# (bidir), TCK/SWCLK (out), TDI (out), TDO/SWO (in), TMS/SWDIO (out), TRACE_CK (in), TRACE_D0 (in), TRACE_D1 (in), TRACE_D2 (in), TRACE_D3 (in), TRST (out)

### Nets
+3V3: CN13.1 CN16.1 CN16.2 R136.2 R139.2 R140.2 R144.2 R145.2
GND: CN13.3 CN13.5 CN13.9 CN13.11 CN13.13 CN13.15 CN13.17 CN13.19 CN16.4 CN16.6 CN16.8 CN16.10 CN16.12 CN16.14 CN16.16 CN16.18 CN16.20 D9.2 D10.2 D11.2 D12.2 D13.2 D14.2 R142.1 R143.1 R148.1 R149.1
PA13: R90.2 ; port TMS/SWDIO
PA14: R99.2 ; port TCK/SWCLK
PA15: R106.2 ; port TDI
PB4: R127.2 ; port TRST
RESET#: R109.2 ; port RESET#
T_JTDO: R103.2 ; port TDO/SWO
NetCN13_2: CN13.2 CN16.7 D9.3 R90.1 R140.1
NetCN13_4: CN13.4 CN16.9 D10.3 R99.1 R142.2
NetCN13_6: CN13.6 CN16.13 D11.3 R103.1 R113.2 R145.1
NetCN13_8: CN13.8 CN16.5 D12.3 R106.1 R139.1
NetCN13_10: CN13.10 CN16.15 D13.3 R109.1
NetCN13_12: CN13.12 ; port TRACE_CK
NetCN13_14: CN13.14 R113.1 ; port TRACE_D0
NetCN13_16: CN13.16 R119.1 ; port TRACE_D1
NetCN13_18: CN13.18 ; port TRACE_D2
NetCN13_20: CN13.20 ; port TRACE_D3
NetCN16_3: CN16.3 D14.3 R119.2 R127.1 R136.1
NetCN16_11: CN16.11 R143.2 R144.1
NetCN16_17: CN16.17 R148.2
NetCN16_19: CN16.19 R149.2

Not connected (* = marked no-connect by the designer): CN13 7

### Notes on the sheet
- PA13
- PA14
- PB3
- PA15
- PB4
- KEY
- (near CN13) FTSH-110-01-L-DV (Samtec)
- PE6
- JTAG connector
- PE5
- PE4
- PE3
- PE2
- Trace connector
- STM324x9I-EVAL JTAG&Trace
- MB1045
- 16
- STMicroelectronics
- Title:
- Number:
- Rev:
- Date:
- Sheet          of

### Library data of the parts
CN13 CN16 = 20PIN1
D9-D14 = BATS5V6
R90 R99 R103 R106 R109 R113 R119 R127 R136 R139 R140 R142-R145 R148 R149 = Res1: Resistor; Value: 1K; Published: 8-Jun-2000; Revision: July-2002: Re-released for DXP Platform.; Publisher: Altium Limited

## Sheet MCU.SchDoc
size A3; Revision: B.2(PCB.SCH)
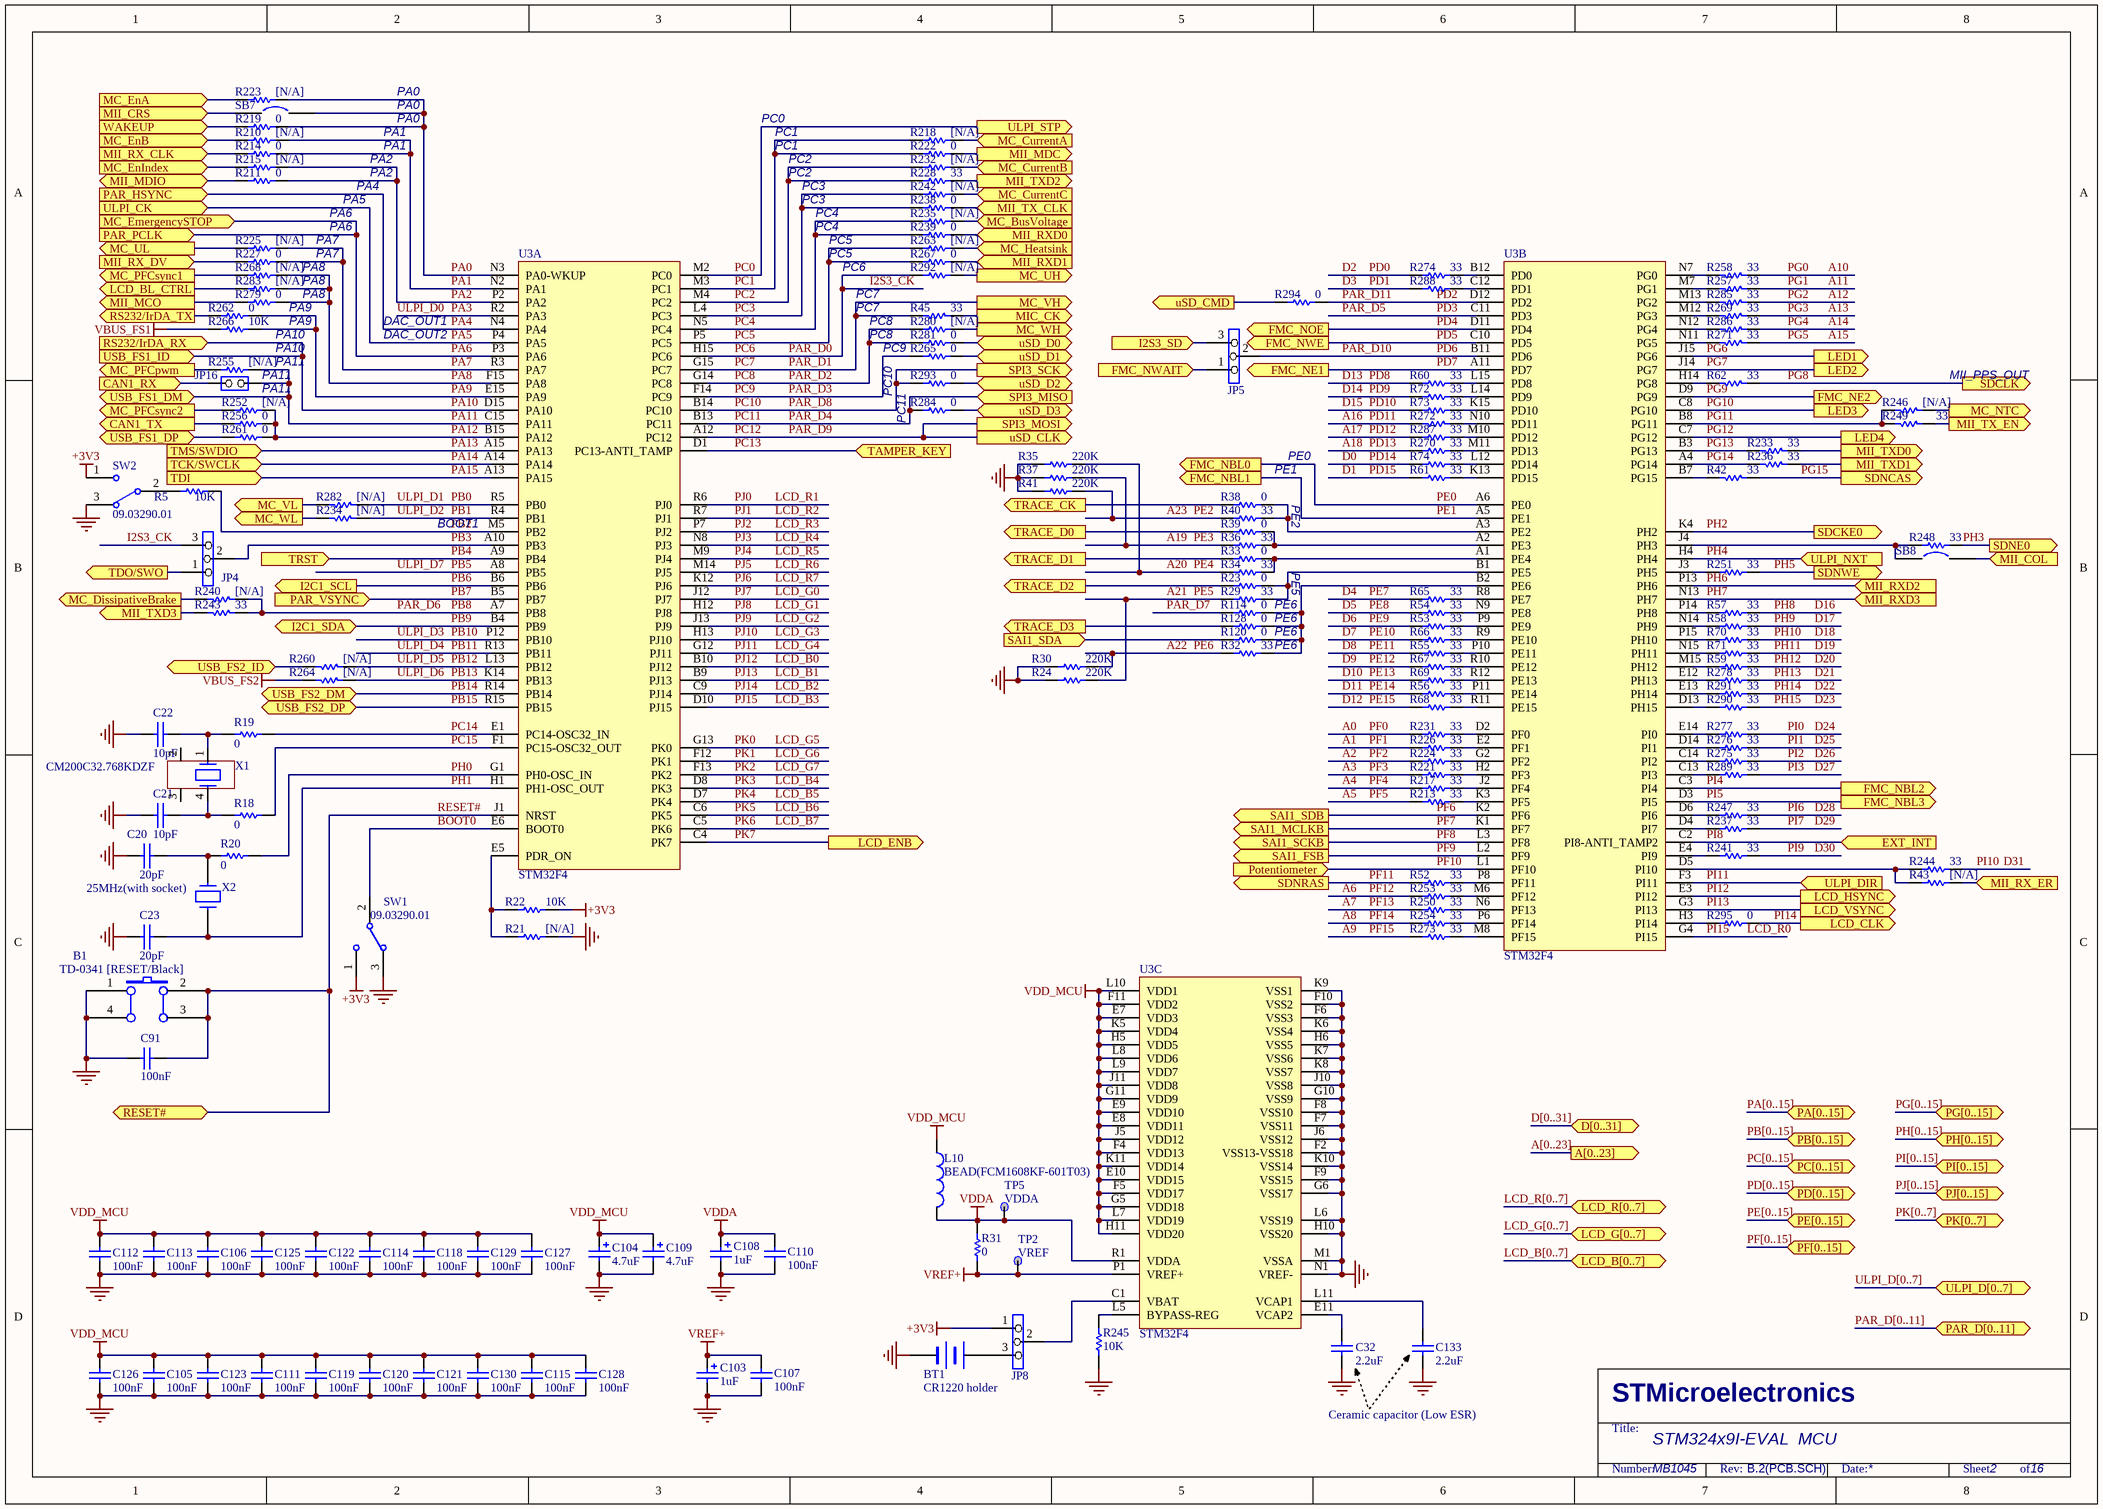
[diagram p3: MCU.SchDoc]

### Parts
B1  TD-0341 [RESET/Black]  [PB10]
BT1  CR1220 holder  [BAT_2SM_CR1220]
C20  20pF  [0603C]
C21  10pF  [0603C]
C22  10pF  [0603C]
C23  20pF  [0603C]
C32  2.2uF  [1206C]
C91  100nF  [0603C]
C103  1uF  [TAN-A]
C104  4.7uF  [TAN-A]
C105  100nF  [0402C]
C106  100nF  [0402C]
C107  100nF  [0402C]
C108  1uF  [TAN-A]
C109  4.7uF  [TAN-A]
C110  100nF  [0402C]
C111  100nF  [0402C]
C112  100nF  [0402C]
C113  100nF  [0402C]
C114  100nF  [0402C]
C115  100nF  [0402C]
C118  100nF  [0402C]
C119  100nF  [0402C]
C120  100nF  [0402C]
C121  100nF  [0402C]
C122  100nF  [0402C]
C123  100nF  [0402C]
C125  100nF  [0402C]
C126  100nF  [0402C]
C127  100nF  [0402C]
C128  100nF  [0402C]
C129  100nF  [0402C]
C130  100nF  [0402C]
C133  2.2uF  [1206C]
JP4  (no value)  [SIP3]
JP5  (no value)  [SIP3]
JP8  (no value)  [SIP3]
JP16  (no value)  [SIP2]
L10  BEAD(FCM1608KF-601T03)  [0603L]
R5  10K  [0603R]
R18  0  [0603R]
R19  0  [0603R]
R20  0  [0603R]
R21  [N/A]  [0603R]
R22  10K  [0603R]
R23  0  [0603R]
R24  220K  [0603R]
R29  33  [0402R]
R30  220K  [0603R]
R31  0  [0603R]
R32  33  [0402R]
R33  0  [0603R]
R34  33  [0402R]
R35  220K  [0603R]
R36  33  [0402R]
R37  220K  [0603R]
R38  0  [0603R]
R39  0  [0603R]
R40  33  [0402R]
R41  220K  [0603R]
R42  33  [0402R]
R43  [N/A]  [0603R]
R45  33  [0603R]
R52  33  [0402R]
R53  33  [0402R]
R54  33  [0402R]
R55  33  [0402R]
R56  33  [0402R]
R57  33  [0402R]
R58  33  [0402R]
R59  33  [0402R]
R60  33  [0402R]
R61  33  [0402R]
R62  33  [0402R]
R65  33  [0402R]
R66  33  [0402R]
R67  33  [0402R]
R68  33  [0402R]
R69  33  [0402R]
R70  33  [0402R]
R71  33  [0402R]
R72  33  [0402R]
R73  33  [0402R]
R74  33  [0402R]
R114  0  [0603R]
R120  0  [0603R]
R128  0  [0603R]
R210  [N/A]  [0603R]
R211  0  [0603R]
R213  33  [0402R]
R214  0  [0603R]
R215  [N/A]  [0603R]
R217  33  [0402R]
R218  [N/A]  [0603R]
R219  0  [0603R]
R221  33  [0402R]
R222  0  [0603R]
R223  [N/A]  [0603R]
R224  33  [0402R]
R225  [N/A]  [0603R]
R226  33  [0402R]
R227  0  [0603R]
R228  33  [0603R]
R231  33  [0402R]
R232  [N/A]  [0603R]
R233  33  [0603R]
R234  [N/A]  [0603R]
R235  [N/A]  [0603R]
R236  33  [0603R]
R237  33  [0402R]
R238  0  [0603R]
R239  0  [0603R]
R240  [N/A]  [0603R]
R241  33  [0402R]
R242  [N/A]  [0603R]
R243  33  [0603R]
R244  33  [0402R]
R245  10K  [0603R]
R246  [N/A]  [0603R]
R247  33  [0402R]
R248  33  [0402R]
R249  33  [0603R]
R250  33  [0402R]
R251  33  [0402R]
R252  [N/A]  [0603R]
R253  33  [0402R]
R254  33  [0402R]
R255  [N/A]  [0603R]
R256  0  [0603R]
R257  33  [0402R]
R258  33  [0402R]
R260  [N/A]  [0603R]
R261  0  [0603R]
R262  0  [0603R]
R263  [N/A]  [0603R]
R264  [N/A]  [0603R]
R265  0  [0603R]
R266  10K  [0603R]
R267  0  [0603R]
R268  [N/A]  [0603R]
R269  33  [0402R]
R270  33  [0402R]
R271  33  [0402R]
R272  33  [0402R]
R273  33  [0402R]
R274  33  [0402R]
R275  33  [0402R]
R276  33  [0402R]
R277  33  [0402R]
R278  33  [0402R]
R279  0  [0603R]
R280  [N/A]  [0603R]
R281  0  [0603R]
R282  [N/A]  [0603R]
R283  [N/A]  [0603R]
R284  0  [0603R]
R285  33  [0402R]
R286  33  [0402R]
R287  33  [0402R]
R288  33  [0402R]
R289  33  [0402R]
R290  33  [0402R]
R291  33  [0402R]
R292  [N/A]  [0603R]
R293  0  [0603R]
R294  0  [0603R]
R295  0  [0603R]
SB7  (no value)  [JP2_SMD]
SB8  (no value)  [JP2_SMD]
SW1  09.03290.01  [SW1_3TH_2R54_10X2R5]
SW2  09.03290.01  [SW1_3TH_2R54_10X2R5]
TP2  VREF  [TP]
TP5  VDDA  [TP]
U3  STM32F4  [BGA216_0R8_13X13_SKT]  (parts A,B,C of 3)
X1  CM200C32.768KDZF  [XTAL_4SM_8X3R8]
X2  25MHz(with socket)  [XTAL_socket]

### Ports
A[0..23] (out), CAN1_RX (in), CAN1_TX (out), D[0..31] (bidir), EXT_INT (in), FMC_NBL0 (out), FMC_NBL1 (out), FMC_NBL2 (out), FMC_NBL3 (out), FMC_NE1 (out), FMC_NE2 (out), FMC_NOE (out), FMC_NWAIT (in), FMC_NWE (out), I2C1_SCL (out), I2C1_SDA (bidir), I2S3_SD (in), LCD_B[0..7] (bidir), LCD_BL_CTRL (out), LCD_CLK (out), LCD_ENB (out), LCD_G[0..7] (bidir), LCD_HSYNC (out), LCD_R[0..7] (bidir), LCD_VSYNC (out), LED1 (out), LED2 (out), LED3 (out), LED4 (out), MC_BusVoltage (in), MC_CurrentA (in), MC_CurrentB (in), MC_CurrentC (in), MC_DissipativeBrake (out), MC_EmergencySTOP (in), MC_EnA (in), MC_EnB (in), MC_EnIndex (in), MC_Heatsink (in), MC_NTC (out), MC_PFCpwm (out), MC_PFCsync1 (out), MC_PFCsync2 (out), MC_UH (out), MC_UL (out), MC_VH (out), MC_VL (out), MC_WH (out), MC_WL (out), MIC_CK (out), MII_COL (in), MII_CRS (in), MII_MCO (out), MII_MDC (out), MII_MDIO (bidir), MII_RX_CLK (in), MII_RX_DV (in), MII_RX_ER (in), MII_RXD0 (in), MII_RXD1 (in), MII_RXD2 (in), MII_RXD3 (in), MII_TX_CLK (in), MII_TX_EN (out), MII_TXD0 (out), MII_TXD1 (out), MII_TXD2 (out), MII_TXD3 (out), PA[0..15] (bidir), PAR_D[0..11] (bidir), PAR_HSYNC (in), PAR_PCLK (in), PAR_VSYNC (in), PB[0..15] (bidir), PC[0..15] (bidir), PD[0..15] (bidir), PE[0..15] (bidir), PF[0..15] (bidir), PG[0..15] (bidir), PH[0..15] (bidir), PI[0..15] (bidir), PJ[0..15] (bidir), PK[0..7] (bidir), Potentiometer (in), RESET# (bidir), RS232/IrDA_RX (in), RS232/IrDA_TX (out), SAI1_FSB (out), SAI1_MCLKB (out), SAI1_SCKB (out), SAI1_SDA (in), SAI1_SDB (out), SDCKE0 (out), SDCLK (out), SDNCAS (out), SDNE0 (out), SDNRAS (out), SDNWE (out), SPI3_MISO (in), SPI3_MOSI (out), SPI3_SCK (out), TAMPER_KEY (in), TCK/SWCLK (in), TDI (in), TDO/SWO (out), TMS/SWDIO (in), TRACE_CK (out), TRACE_D0 (out), TRACE_D1 (out), TRACE_D2 (out), TRACE_D3 (out), TRST (in), ULPI_CK (in), ULPI_D[0..7] (bidir), ULPI_DIR (in), ULPI_NXT (in), ULPI_STP (out), USB_FS1_DM (bidir), USB_FS1_DP (bidir), USB_FS1_ID (in), USB_FS2_DM (bidir), USB_FS2_DP (bidir), USB_FS2_ID (bidir), uSD_CLK (out), uSD_CMD (out), uSD_D0 (bidir), uSD_D1 (bidir), uSD_D2 (bidir), uSD_D3 (bidir), WAKEUP (in)

### Nets
+3V3: JP8.1 R22.2 SW1.1 SW2.1
GND: B1.1(A0) B1.4(A1) BT1.2(-) C20.2 C21.2 C22.2 C23.2 C32.2 C91.1 C103.2 C104.2 C105.2 C106.2 C107.1 C108.2 C109.2 C110.1 C111.2 C112.2 C113.2 C114.2 C115.2 C118.2 C119.2 C120.2 C121.2 C122.2 C123.2 C125.2 C126.2 C127.2 C128.2 C129.2 C130.2 C133.2 R21.2 R24.1 R30.1 R35.1 R37.1 R41.1 R245.1 SW1.3 SW2.3 U3.F2(VSS13-VSS18) U3.F6(VSS3) U3.F7(VSS11) U3.F8(VSS10) U3.F9(VSS15) U3.F10(VSS2) U3.G6(VSS17) U3.G10(VSS9) U3.H6(VSS5) U3.H10(VSS20) U3.J6(VSS12) U3.J10(VSS8) U3.K6(VSS4) U3.K7(VSS6) U3.K8(VSS7) U3.K9(VSS1) U3.K10(VSS14) U3.L6(VSS19) U3.M1(VSSA) U3.N1(VREF-)
VBUS_FS1: R266.2
VBUS_FS2: R264.1
VDD_MCU: C104.1 C105.1 C106.1 C109.1 C111.1 C112.1 C113.1 C114.1 C115.1 C118.1 C119.1 C120.1 C121.1 C122.1 C123.1 C125.1 C126.1 C127.1 C128.1 C129.1 C130.1 L10.1 U3.E7(VDD3) U3.E8(VDD11) U3.E9(VDD10) U3.E10(VDD15) U3.F4(VDD13) U3.F5(VDD17) U3.F11(VDD2) U3.G5(VDD18) U3.G11(VDD9) U3.H5(VDD5) U3.H11(VDD20) U3.J5(VDD12) U3.J11(VDD8) U3.K5(VDD4) U3.K11(VDD14) U3.L7(VDD19) U3.L8(VDD6) U3.L9(VDD7) U3.L10(VDD1)
VDDA: C108.1 C110.2 L10.2 R31.1 TP5.1 U3.R1(VDDA)
VREF+: C103.1 C107.2 R31.2 TP2.1 U3.P1(VREF+)
A0: R231.2  [also labelled PF0]
A1: R226.2  [also labelled PF1]
A2: R224.2  [also labelled PF2]
A3: R221.2  [also labelled PF3]
A4: R217.2  [also labelled PF4]
A5: R213.2  [also labelled PF5]
A6: R253.2  [also labelled PF12]
A7: R250.2  [also labelled PF13]
A8: R254.2  [also labelled PF14]
A9: R273.2  [also labelled PF15]
A10: R258.2  [also labelled PG0]
A11: R257.2  [also labelled PG1]
A12: R285.2  [also labelled PG2]
A13: R269.2  [also labelled PG3]
A14: R286.2  [also labelled PG4]
A15: R271.2  [also labelled PG5]
A16: R272.1  [also labelled PD11]
A17: R287.2  [also labelled PD12]
A18: R270.2  [also labelled PD13]
A19: R36.2 R37.2  [also labelled PE3]
A20: R34.2 R35.2  [also labelled PE4]
A21: R24.2 R29.2  [also labelled PE5]
A22: R30.2 R32.2  [also labelled PE6]
A23: R40.2 R41.2  [also labelled PE2]
BOOT0: SW1.2 U3.E6(BOOT0)
D0: R74.2  [also labelled PD14]
D1: R61.2  [also labelled PD15]
D2: R274.2  [also labelled PD0]
D3: R288.2  [also labelled PD1]
D4: R65.2  [also labelled PE7]
D5: R54.2  [also labelled PE8]
D6: R53.2  [also labelled PE9]
D7: R66.2  [also labelled PE10]
D8: R55.2  [also labelled PE11]
D9: R67.2  [also labelled PE12]
D10: R69.2  [also labelled PE13]
D11: R56.2  [also labelled PE14]
D12: R68.2  [also labelled PE15]
D13: R60.2  [also labelled PD8]
D14: R72.2  [also labelled PD9]
D15: R73.2  [also labelled PD10]
D16: R57.1  [also labelled PH8]
D17: R58.1  [also labelled PH9]
D18: R70.1  [also labelled PH10]
D19: R71.1  [also labelled PH11]
D20: R59.1  [also labelled PH12]
D21: R278.1  [also labelled PH13]
D22: R291.1  [also labelled PH14]
D23: R290.1  [also labelled PH15]
D24: R277.1  [also labelled PI0]
D25: R276.1  [also labelled PI1]
D26: R275.1  [also labelled PI2]
D27: R289.1  [also labelled PI3]
D28: R247.1  [also labelled PI6]
D29: R237.1  [also labelled PI7]
D30: R241.1  [also labelled PI9]
D31: R244.1  [also labelled PI10]
I2S3_CK: JP4.3 R292.2 U3.H15(PC6)  [also labelled PAR_D0, PC6]
LCD_B0: U3.B10(PJ12)  [also labelled PJ12]
LCD_B1: U3.B9(PJ13)  [also labelled PJ13]
LCD_B2: U3.C9(PJ14)  [also labelled PJ14]
LCD_B3: U3.D10(PJ15)  [also labelled PJ15]
LCD_B4: U3.D8(PK3)  [also labelled PK3]
LCD_B5: U3.D7(PK4)  [also labelled PK4]
LCD_B6: U3.C6(PK5)  [also labelled PK5]
LCD_B7: U3.C5(PK6)  [also labelled PK6]
LCD_G0: U3.J12(PJ7)  [also labelled PJ7]
LCD_G1: U3.H12(PJ8)  [also labelled PJ8]
LCD_G2: U3.J13(PJ9)  [also labelled PJ9]
LCD_G3: U3.H13(PJ10)  [also labelled PJ10]
LCD_G4: U3.G12(PJ11)  [also labelled PJ11]
LCD_G5: U3.G13(PK0)  [also labelled PK0]
LCD_G6: U3.F12(PK1)  [also labelled PK1]
LCD_G7: U3.F13(PK2)  [also labelled PK2]
LCD_R0: U3.G4(PI15)  [also labelled PI15]
LCD_R1: U3.R6(PJ0)  [also labelled PJ0]
LCD_R2: U3.R7(PJ1)  [also labelled PJ1]
LCD_R3: U3.P7(PJ2)  [also labelled PJ2]
LCD_R4: U3.N8(PJ3)  [also labelled PJ3]
LCD_R5: U3.M9(PJ4)  [also labelled PJ4]
LCD_R6: U3.M14(PJ5)  [also labelled PJ5]
LCD_R7: U3.K12(PJ6)  [also labelled PJ6]
PA0: R219.1 R223.1 SB7.2 U3.N3(PA0-WKUP)
PA1: R210.1 R214.1 U3.N2(PA1)
PA2: R211.1 R215.1 U3.P2(PA2)
PA3: U3.R2(PA3)  [also labelled ULPI_D0]
PA4: U3.N4(PA4) ; port PAR_HSYNC
PA5: U3.P4(PA5) ; port ULPI_CK
PA6: U3.P3(PA6) ; port MC_EmergencySTOP, port PAR_PCLK
PA7: R225.1 R227.1 U3.R3(PA7)
PA8: R268.1 R279.1 R283.1 U3.F15(PA8)
PA9: R262.1 R266.1 U3.E15(PA9)
PA10: U3.D15(PA10) ; port RS232/IrDA_RX, port USB_FS1_ID
PA11: JP16.1(COMMON) R255.1 U3.C15(PA11) ; port USB_FS1_DM
PA12: R252.1 R256.1 R261.1 U3.B15(PA12)
PA13: U3.A15(PA13) ; port TMS/SWDIO
PA14: U3.A14(PA14) ; port TCK/SWCLK
PA15: U3.A13(PA15) ; port TDI
PAR_D1: R45.1 U3.G15(PC7) ; port MC_VH  [also labelled PC7]
PAR_D2: R280.2 R281.2 U3.G14(PC8)  [also labelled PC8]
PAR_D3: R265.2 U3.F14(PC9)  [also labelled PC9]
PAR_D4: R284.2 U3.B13(PC11) ; port SPI3_MISO  [also labelled PC11]
PAR_D5: U3.C11(PD3)  [also labelled PD3]
PAR_D6: R240.2 R243.2 U3.A7(PB8)  [also labelled PB8]
PAR_D7: R114.1
PAR_D8: R293.2 U3.B14(PC10) ; port SPI3_SCK  [also labelled PC10]
PAR_D9: U3.A12(PC12) ; port uSD_CLK, port SPI3_MOSI  [also labelled PC12]
PAR_D10: JP5.2 U3.B11(PD6)  [also labelled PD6]
PAR_D11: R294.2 U3.D12(PD2)  [also labelled PD2]
PB0: R282.2 U3.R5(PB0)  [also labelled ULPI_D1]
PB1: R234.2 U3.R4(PB1)  [also labelled ULPI_D2]
PB2: R5.2 U3.M5(PB2)
PB3: JP4.2 U3.A10(PB3)
PB4: U3.A9(PB4) ; port TRST
PB5: U3.A8(PB5)  [also labelled ULPI_D7]
PB6: U3.B6(PB6) ; port I2C1_SCL  [project net I2C1_SCL]
PB7: U3.B5(PB7) ; port PAR_VSYNC
PB9: U3.B4(PB9) ; port I2C1_SDA  [project net I2C1_SDA]
PB10: U3.P12(PB10)  [also labelled ULPI_D3]
PB11: U3.R13(PB11)  [also labelled ULPI_D4]
PB12: R260.2 U3.L13(PB12)  [also labelled ULPI_D5]
PB13: R264.2 U3.K14(PB13)  [also labelled ULPI_D6]
PB14: U3.R14(PB14) ; port USB_FS2_DM
PB15: U3.R15(PB15) ; port USB_FS2_DP
PC0: U3.M2(PC0) ; port ULPI_STP
PC1: R218.2 R222.2 U3.M3(PC1)
PC2: R228.2 R232.2 U3.M4(PC2)
PC3: R238.2 R242.2 U3.L4(PC3)
PC4: R235.2 R239.2 U3.N5(PC4)
PC5: R263.2 R267.2 U3.P5(PC5)
PC13: U3.D1(PC13-ANTI_TAMP) ; port TAMPER_KEY
PC14: R19.2 U3.E1(PC14-OSC32_IN)
PC15: R18.2 U3.F1(PC15-OSC32_OUT)
PD4: U3.D11(PD4) ; port FMC_NOE
PD5: U3.C10(PD5) ; port FMC_NWE
PD7: U3.A11(PD7) ; port FMC_NE1
PE0: U3.A6(PE0) ; port FMC_NBL0
PE1: U3.A5(PE1) ; port FMC_NBL1
PF6: U3.K2(PF6) ; port SAI1_SDB
PF7: U3.K1(PF7) ; port SAI1_MCLKB
PF8: U3.L3(PF8) ; port SAI1_SCKB
PF9: U3.L2(PF9) ; port SAI1_FSB
PF10: U3.L1(PF10) ; port Potentiometer
PF11: R52.2 ; port SDNRAS
PG6: U3.J15(PG6) ; port LED1
PG7: U3.J14(PG7) ; port LED2
PG8: R62.2 ; port SDCLK
PG9: U3.D9(PG9) ; port FMC_NE2
PG10: U3.C8(PG10) ; port LED3
PG11: R246.1 R249.1 U3.B8(PG11)
PG12: U3.C7(PG12) ; port LED4
PG13: R233.1 U3.B3(PG13)
PG14: R236.1 U3.A4(PG14)
PG15: R42.2 ; port SDNCAS
PH0: R20.1 U3.G1(PH0-OSC_IN)
PH1: C23.1 U3.H1(PH1-OSC_OUT) X2.1
PH2: U3.K4(PH2) ; port SDCKE0
PH3: R248.1 ; port SDNE0
PH4: U3.H4(PH4) ; port ULPI_NXT
PH5: R251.1 ; port SDNWE
PH6: U3.P13(PH6) ; port MII_RXD2
PH7: U3.N13(PH7) ; port MII_RXD3
PI4: U3.C3(PI4) ; port FMC_NBL2
PI5: U3.D3(PI5) ; port FMC_NBL3
PI8: U3.C2(PI8-ANTI_TAMP2) ; port EXT_INT
PI11: U3.F3(PI11) ; port ULPI_DIR
PI12: U3.E3(PI12) ; port LCD_HSYNC
PI13: U3.G3(PI13) ; port LCD_VSYNC
PI14: R295.1 ; port LCD_CLK
PK7: U3.C4(PK7) ; port LCD_ENB
RESET#: B1.2(B0) B1.3(B1) C91.2 U3.J1(NRST) ; port RESET#
T_JTDO: JP4.1 ; port TDO/SWO
NetBT1_1: BT1.1(+) JP8.3
NetC6_2: R223.2 ; port MC_EnA
NetC7_2: R252.2 ; port MC_PFCsync2
NetC8_2: R210.2 ; port MC_EnB
NetC9_2: R215.2 ; port MC_EnIndex
NetC10_2: R255.2 ; port MC_PFCpwm
NetC11_1: R263.1 ; port MC_Heatsink
NetC12_2: R242.1 ; port MC_CurrentC
NetC13_2: R232.1 ; port MC_CurrentB
NetC14_2: R218.1 ; port MC_CurrentA
NetC15_1: R235.1 ; port MC_BusVoltage
NetC18_2: R268.2 ; port MC_PFCsync1
NetC20_1: C20.1 R20.2 X2.2
NetC21_1: C21.1 R18.1 X1.4
NetC22_1: C22.1 R19.1 X1.1
NetC32_1: C32.1 U3.E11(VCAP2)
NetC133_1: C133.1 U3.L11(VCAP1)
NetCN1_3: R292.1 ; port MC_UH
NetCN1_5: R225.2 ; port MC_UL
NetCN1_9: R282.1 ; port MC_VL
NetCN1_11: R280.1 ; port MC_WH
NetCN1_13: R234.1 ; port MC_WL
NetCN1_21: R246.2 ; port MC_NTC
NetCN1_23: R240.1 ; port MC_DissipativeBrake
NetCN12_6: JP5.1 ; port FMC_NWAIT
NetCN13_12: R38.1 ; port TRACE_CK
NetCN13_14: R39.1 ; port TRACE_D0
NetCN13_16: R33.1 ; port TRACE_D1
NetCN13_18: R23.1 ; port TRACE_D2
NetCN13_20: R128.1 ; port TRACE_D3
NetCN15_4: R260.1 ; port USB_FS2_ID
NetCN17_1: R293.1 ; port uSD_D2
NetCN17_2: R284.1 ; port uSD_D3
NetCN17_3: R294.1 ; port uSD_CMD
NetCN17_7: R281.1 ; port uSD_D0
NetCN17_8: R265.1 ; port uSD_D1
NetCN20_43: R283.2 ; port LCD_BL_CTRL
NetD5_C3: R261.2 ; port USB_FS1_DP
NetJP5_3: JP5.3 ; port I2S3_SD
NetJP6_3: R279.2 ; port MII_MCO
NetJP8_2: JP8.2 U3.C1(VBAT)
NetJP15_3: R45.2 ; port MIC_CK
NetJP16_2: JP16.2(NO) ; port CAN1_RX
NetR5_1: R5.1 SW2.2
NetR21_1: R21.1 R22.1 U3.E5(PDR_ON)
NetR23_2: R23.2 R29.1 U3.B1(PE5)
NetR32_1: R32.1 R114.2 R120.1 R128.2 U3.B2(PE6)
NetR33_2: R33.2 R34.1 U3.A1(PE4)
NetR36_1: R36.1 R39.2 U3.A2(PE3)
NetR38_2: R38.2 R40.1 U3.A3(PE2)
NetR42_1: R42.1 U3.B7(PG15)
NetR43_1: R43.1 ; port MII_RX_ER
NetR43_2: R43.2 R244.2 U3.D5(PI10)
NetR48_2: R267.1 ; port MII_RXD1
NetR49_2: R239.1 ; port MII_RXD0
NetR50_2: R227.2 ; port MII_RX_DV
NetR51_2: R214.2 ; port MII_RX_CLK
NetR52_1: R52.1 U3.P8(PF11)
NetR53_1: R53.1 U3.P9(PE9)
NetR54_1: R54.1 U3.N9(PE8)
NetR55_1: R55.1 U3.P10(PE11)
NetR56_1: R56.1 U3.P11(PE14)
NetR57_2: R57.2 U3.P14(PH8)
NetR58_2: R58.2 U3.N14(PH9)
NetR59_2: R59.2 U3.M15(PH12)
NetR60_1: R60.1 U3.L15(PD8)
NetR61_1: R61.1 U3.K13(PD15)
NetR62_1: R62.1 U3.H14(PG8)
NetR63_2: R238.1 ; port MII_TX_CLK
NetR65_1: R65.1 U3.R8(PE7)
NetR66_1: R66.1 U3.R9(PE10)
NetR67_1: R67.1 U3.R10(PE12)
NetR68_1: R68.1 U3.R11(PE15)
NetR69_1: R69.1 U3.R12(PE13)
NetR70_2: R70.2 U3.P15(PH10)
NetR71_2: R71.2 U3.N15(PH11)
NetR72_1: R72.1 U3.L14(PD9)
NetR73_1: R73.1 U3.K15(PD10)
NetR74_1: R74.1 U3.L12(PD14)
NetR75_1: R211.2 ; port MII_MDIO
NetR120_2: R120.2 ; port SAI1_SDA
NetR193_2: R219.2 ; port WAKEUP
NetR213_1: R213.1 U3.K3(PF5)
NetR217_1: R217.1 U3.J2(PF4)
NetR221_1: R221.1 U3.H2(PF3)
NetR222_1: R222.1 ; port MII_MDC
NetR224_1: R224.1 U3.G2(PF2)
NetR226_1: R226.1 U3.E2(PF1)
NetR228_1: R228.1 ; port MII_TXD2
NetR231_1: R231.1 U3.D2(PF0)
NetR233_2: R233.2 ; port MII_TXD0
NetR236_2: R236.2 ; port MII_TXD1
NetR237_2: R237.2 U3.D4(PI7)
NetR241_2: R241.2 U3.E4(PI9)
NetR243_1: R243.1 ; port MII_TXD3
NetR245_2: R245.2 U3.L5(BYPASS-REG)
NetR247_2: R247.2 U3.D6(PI6)
NetR248_2: R248.2 SB8.1 U3.J4(PH3)
NetR249_2: R249.2 ; port MII_TX_EN
NetR250_1: R250.1 U3.N6(PF13)
NetR251_2: R251.2 U3.J3(PH5)
NetR253_1: R253.1 U3.M6(PF12)
NetR254_1: R254.1 U3.P6(PF14)
NetR256_2: R256.2 ; port CAN1_TX
NetR257_1: R257.1 U3.M7(PG1)
NetR258_1: R258.1 U3.N7(PG0)
NetR262_2: R262.2 ; port RS232/IrDA_TX
NetR269_1: R269.1 U3.M12(PG3)
NetR270_1: R270.1 U3.M11(PD13)
NetR271_1: R271.1 U3.N11(PG5)
NetR272_2: R272.2 U3.N10(PD11)
NetR273_1: R273.1 U3.M8(PF15)
NetR274_1: R274.1 U3.B12(PD0)
NetR275_2: R275.2 U3.C14(PI2)
NetR276_2: R276.2 U3.D14(PI1)
NetR277_2: R277.2 U3.E14(PI0)
NetR278_2: R278.2 U3.E12(PH13)
NetR285_1: R285.1 U3.M13(PG2)
NetR286_1: R286.1 U3.N12(PG4)
NetR287_1: R287.1 U3.M10(PD12)
NetR288_1: R288.1 U3.C12(PD1)
NetR289_2: R289.2 U3.C13(PI3)
NetR290_2: R290.2 U3.D13(PH15)
NetR291_2: R291.2 U3.E13(PH14)
NetR295_2: R295.2 U3.H3(PI14)
NetSB7_1: SB7.1 ; port MII_CRS
NetSB8_2: SB8.2 ; port MII_COL

Not connected (* = marked no-connect by the designer): X1 2 3

### Buses and harness runs
bus A[0..23] = port A[0..23]
bus D[0..31] = port D[0..31]
bus LCD_B[0..7] = port LCD_B[0..7]
bus LCD_G[0..7] = port LCD_G[0..7]
bus LCD_R[0..7] = port LCD_R[0..7]
bus PA[0..15] = port PA[0..15]
bus PAR_D[0..11] = port PAR_D[0..11]
bus PB[0..15] = port PB[0..15]
bus PC[0..15] = port PC[0..15]
bus PD[0..15] = port PD[0..15]
bus PE[0..15] = port PE[0..15]
bus PF[0..15] = port PF[0..15]
bus PG[0..15] = port PG[0..15]
bus PH[0..15] = port PH[0..15]
bus PI[0..15] = port PI[0..15]
bus PJ[0..15] = port PJ[0..15]
bus PK[0..7] = port PK[0..7]
bus ULPI_D[0..7] = port ULPI_D[0..7]

### Notes on the sheet
- PA0
- PA2
- PA1
- PC0
- PC1
- PC2
- PA7
- PA6
- PA5
- PA4
- PC3
- PC4
- PC5
- PA9
- PA8
- PC6
- PC7
- PA11
- PA10
- DAC_OUT1
- DAC_OUT2
- PC8
- PC9
- MII_PPS_OUT
- PC10
- PC11
- PE1
- PE0
- PE2
- BOOT1
- PE5
- PE6
- Ceramic capacitor (Low ESR)
- STM324x9I-EVAL  MCU
- MB1045
- 2
- 16
- STMicroelectronics
- Title:
- Number:
- Rev:
- Date:
- Sheet          of

### Library data of the parts
B1 = SW PUSHBUTTON: SE PUSHBUTTON
BT1 = BATTERY
C20-C23 C105 C106 C111-C115 C118-C123 C125-C130 = CAP: Capacitor
  C105 C106 C111-C115 C118-C123 C125-C130: Published: 8-Jun-2000; Revision: July-2002: Re-released for DXP Platform.; Publisher: Altium Limited; Value: 100nF
C32 C107 C110 C133 = Cap: Capacitor; Value: 10nF; Published: 8-Jun-2000; Revision: July-2002: Re-released for DXP Platform.; Publisher: Altium Limited
C91 = CAP: Capacitor; Value: 100pF; Published: 8-Jun-2000; Revision: July-2002: Re-released for DXP Platform.; Publisher: Altium Limited
C103 C108 = Cap Pol1: Polarized Capacitor (Radial); Value: 10uF; Published: 8-Jun-2000; Revision: July-2002: Re-released for DXP Platform.; Publisher: Altium Limited
C104 C109 = Cap Pol1: Polarized Capacitor (Radial); Value: 47uF; Published: 8-Jun-2000; Revision: July-2002: Re-released for DXP Platform.; Publisher: Altium Limited
JP4 JP5 JP8 = Jumper3
JP16 = JP2
L10 = Inductor: Value: 100uH; Published: 8-Jun-2000; Revision: July-2002: Re-released for DXP Platform.; Publisher: Altium Limited
R5 R18-R23 R29 R31-R34 R36 R38-R40 R42 R43 R45 R52-R62 R65-R74 R114 R120 R128 R210 R211 R213-R215 R217-R219 R221-R228 R231-R258 R260-R265 R267-R295 = Res1: Resistor; Value: 1K; Published: 8-Jun-2000; Revision: July-2002: Re-released for DXP Platform.; Publisher: Altium Limited
R24 R30 R35 R37 R41 R266 = res1: Resistor; Value: 1K; Published: 8-Jun-2000; Revision: July-2002: Re-released for DXP Platform.; Publisher: Altium Limited
SB7 SB8 = Circuit Breaker: Published: 24-Mar-1999; Revision: July-2002: Re-released for DXP Platform.; Publisher: Altium Limited
SW1 SW2 = SW-SPDT: SPDT Subminiature Toggle Switch, Right Angle Mounting, Vertical Actuation; Revision 1: Jul-2002: Re-released for DXP Platform.; Revision 2: 17-Dec-2003: Schematic revised, PCB Footprint replaced.; Published: 24-Mar-1999; Datasheet: Latest Revision: 05-Dec-2000; Publisher: Altium Limited
TP2 TP5 = TP
U3 = Big_Manta_TFBGA216
X1 = MC306
X2 = CRYSTAL